# Altium schematic sheet Sheet1.SchDoc
size A4
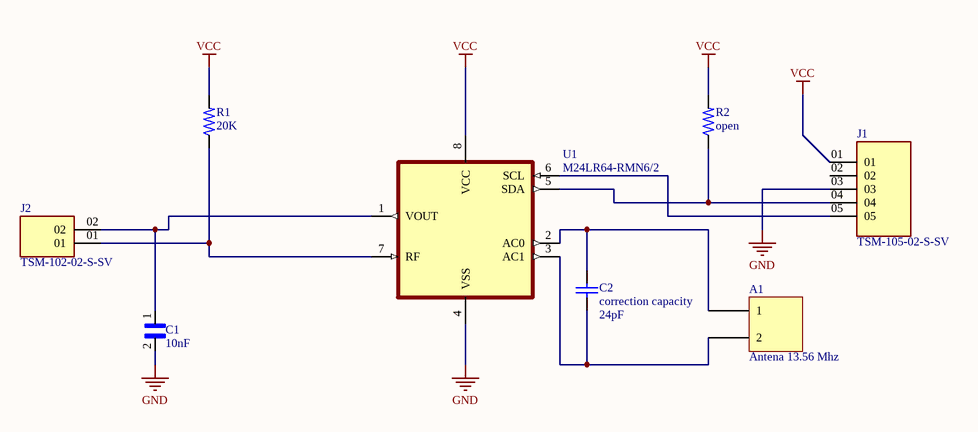
[diagram p0: Sheet1.SchDoc]

## Parts
A1  Antena 13.56 Mhz  [pcb_antenna]
C1  10nF  [CAPC2012X140N]
C2  correction capacity  value 24pF  [6-0805_M]
J1  TSM-105-02-S-SV  [SAMTEC_TSM-105-02-S-SV]
J2  TSM-102-02-S-SV  [SAMTEC_TSM-102-02-S-SV]
R1  20K  [RESC2012X65N]
R2  open  [RESC2012X65N]
U1  M24LR64-RMN6/2  [SOIC127P600X175-8N]

## Nets
GND: C1.2 J1.03 U1.4(VSS)
VCC: J1.01 R1.2 R2.2 U1.8(VCC)
NetA1_1: A1.1 C2.2 U1.2(AC0)
NetA1_2: A1.2 C2.1 U1.3(AC1)
NetC1_1: C1.1 J2.02 U1.1(VOUT)
NetJ1_04: J1.04 R2.1 U1.5(SDA)
NetJ1_05: J1.05 U1.6(SCL)
NetJ2_01: J2.01 R1.1 U1.7(RF)

Not connected (* = marked no-connect by the designer): J1 02

## Library data of the parts
A1 = PCB_ANTENNA: Antenna 13.56 Mhz
C1 = 08053G334ZAT2A: Cap Ceramic 10nF; Package: None; Price: None; Value: *; MP: 08053G334ZAT2A; Availability: Unavailable
C2 = Cap: Capacitor; Published: 8-Jun-2000; LatestRevisionDate: 17-Jul-2002; LatestRevisionNote: Re-released for DXP Platform.; PackageReference: RAD-0.3; Publisher: Altium Limited; PackageDescription: Radial Cap, Thru-Hole; 2 Leads; 0.3 in Pin Spacing
J1 = TSM-105-02-S-SV: Conn Unshrouded Header HDR 5 POS 2.54mm Solder ST SMD Tube; MF: Samtec; Check_prices: https://www.snapeda.com/parts/TSM-105-02-S-SV/Samtec/view-part/?ref=eda; MP: TSM-105-02-S-SV; Value: *; Availability: In Stock; Price: None; SnapEDA_Link: https://www.snapeda.com/parts/TSM-105-02-S-SV/Samtec/view-part/?ref=snap; Package: None; Purchase-URL: https://pricing.snapeda.com/search/part/TSM-105-02-S-SV/?ref=eda
J2 = TSM-102-02-S-SV: Conn Unshrouded Header HDR 2 POS 2.54mm Solder ST SMD T/R; MF: Samtec Inc.; MP: TSM-102-02-S-SV-P-TR; Check_prices: https://www.snapeda.com/parts/TSM-102-02-S-SV-P-TR/Samtec%20Inc./view-part/3255768/?ref=eda; Value: *; SnapEDA_Link: https://www.snapeda.com/parts/TSM-102-02-S-SV-P-TR/Samtec%20Inc./view-part/3255768/?ref=snap; Price: None; Availability: Unavailable; Package: None; Purchase-URL: https://pricing.snapeda.com/search/part/TSM-102-02-S-SV-P-TR/?ref=eda
R1 = 1676221-2: RN 0805 20K 0.1% 10PPM 1KRL; Price: None; Package: None; Availability: Unavailable; MP: 1676221-2; Value: *
R2 = 1676221-2: Price: None; Package: None; Availability: Unavailable; MP: 1676221-2; Value: *
U1 = M24LR64-RMN6/2: 64 Kbit EEPROM; MP: M24LR64-RMN6-2; Package: None; Price: None; Value: *; Availability: Unavailable